# EAGLE design mod (EAGLE 7.1.0)
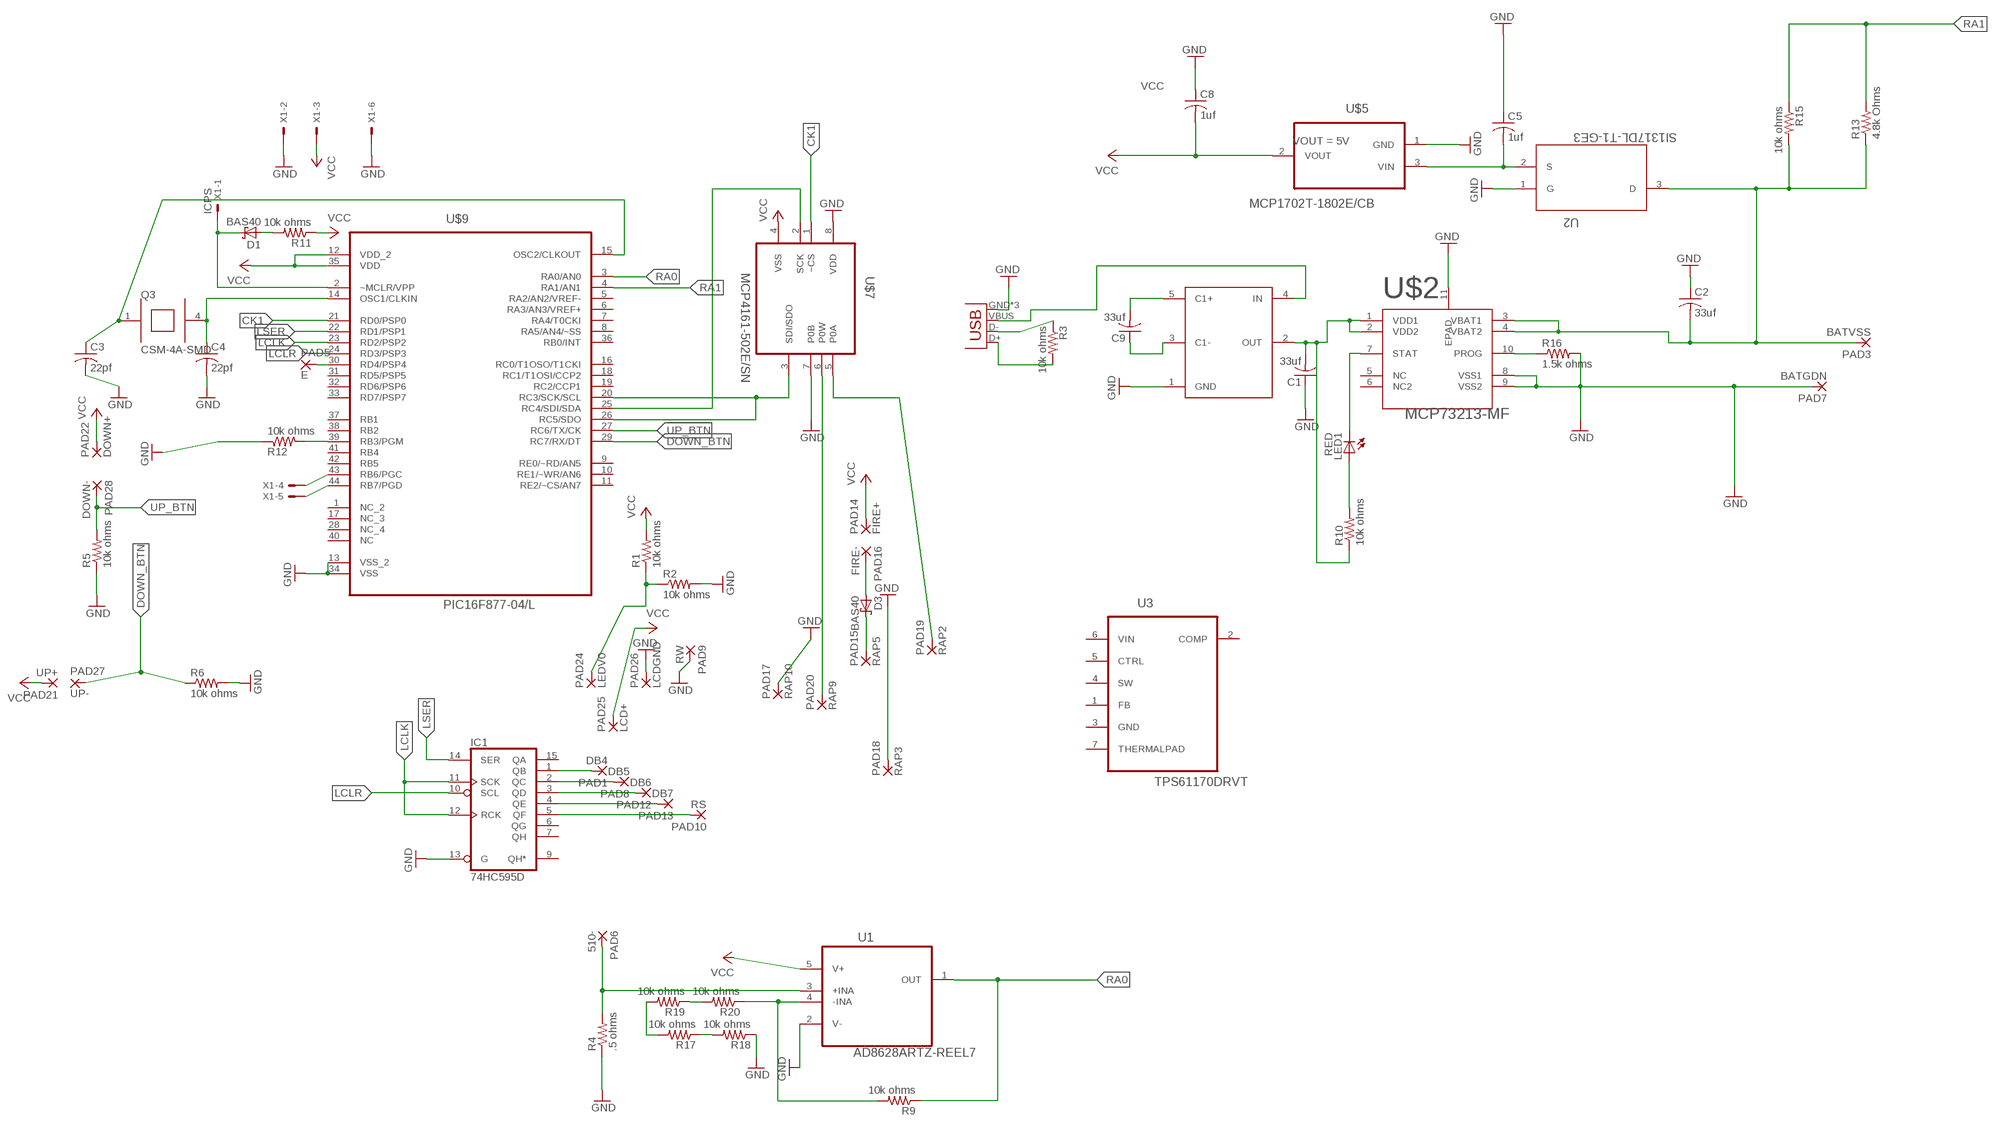
[diagram p0: schematic, sheet 1]

## Parts
C1  33uf  C-USC0805  [C0805]
C2  33uf  C-USC0805  [C0805]
C3  22pf  C-USC0805  [C0805]
C4  22pf  C-USC0805  [C0805]
C5  1uf  C-USC0805  [C0805]
C8  1uf  C-USC0805  [C0805]
C9  33uf  C-USC0805  [C0805]
D1  BAS40  [SOT23]
D3  BAS40  [SOT23]
IC1  74HC595D  [SO16]
LED1  RED  LEDCHIPLED_1206  [CHIPLED_1206]
PAD1  DB4  WIREPADSMD1,27-254  [SMD1,27-2,54]
PAD3  BATVSS  WIREPADSMD1,27-254  [SMD1,27-2,54]
PAD5  E  WIREPADSMD1,27-254  [SMD1,27-2,54]
PAD6  510-  WIREPADSMD1,27-254  [SMD1,27-2,54]
PAD7  BATGDN  WIREPADSMD1,27-254  [SMD1,27-2,54]
PAD8  DB5  WIREPADSMD1,27-254  [SMD1,27-2,54]
PAD9  RW  WIREPADSMD1,27-254  [SMD1,27-2,54]
PAD10  RS  WIREPADSMD1,27-254  [SMD1,27-2,54]
PAD12  DB6  WIREPADSMD1,27-254  [SMD1,27-2,54]
PAD13  DB7  WIREPADSMD1,27-254  [SMD1,27-2,54]
PAD14  FIRE+  WIREPADSMD1,27-254  [SMD1,27-2,54]
PAD15  RAP5  WIREPADSMD1,27-254  [SMD1,27-2,54]
PAD16  FIRE-  WIREPADSMD1,27-254  [SMD1,27-2,54]
PAD17  RAP10  WIREPADSMD1,27-254  [SMD1,27-2,54]
PAD18  RAP3  WIREPADSMD1,27-254  [SMD1,27-2,54]
PAD19  RAP2  WIREPADSMD1,27-254  [SMD1,27-2,54]
PAD20  RAP9  WIREPADSMD1,27-254  [SMD1,27-2,54]
PAD21  UP+  WIREPADSMD1,27-254  [SMD1,27-2,54]
PAD22  DOWN+  WIREPADSMD1,27-254  [SMD1,27-2,54]
PAD24  LEDV0  WIREPADSMD1,27-254  [SMD1,27-2,54]
PAD25  LCD+  WIREPADSMD1,27-254  [SMD1,27-2,54]
PAD26  LCDGND  WIREPADSMD1,27-254  [SMD1,27-2,54]
PAD27  UP-  WIREPADSMD1,27-254  [SMD1,27-2,54]
PAD28  DOWN-  WIREPADSMD1,27-254  [SMD1,27-2,54]
Q3  CSM-4A-SMD  [HC49/US]
R1  10k ohms  R-US_R0805  [R0805]
R2  10k ohms  R-US_R0805  [R0805]
R3  10k ohms  R-US_R0805  [R0805]
R4  .5 ohms  R-US_R0805  [R0805]
R5  10k ohms  R-US_R0805  [R0805]
R6  10k ohms  R-US_R0805  [R0805]
R9  10k ohms  R-US_R0805  [R0805]
R10  10k ohms  R-US_R0805  [R0805]
R11  10k ohms  R-US_R0805  [R0805]
R12  10k ohms  R-US_R0805  [R0805]
R13  4.8k Ohms  R-US_R0805  [R0805]
R15  10k ohms  R-US_R0805  [R0805]
R16  1.5k ohms  R-US_R0805  [R0805]
R17  10k ohms  R-US_R0805  [R0805]
R18  10k ohms  R-US_R0805  [R0805]
R19  10k ohms  R-US_R0805  [R0805]
R20  10k ohms  R-US_R0805  [R0805]
U1  AD8628ARTZ-REEL7  [SOT95P290X145-5N]
U2  SI1317DL-T1-GE3  [SOT65P210X110-3N]
U3  TPS61170DRVT  [SON65P210X210X80-7N]
U$2  MCP73213-MF  [10-DFN]
U$3  MAX1683-5-SOT23  [SOT23-1]
U$5  MCP1702T-1802E/CB  [SOT95P300X145-3N]
U$7  MCP4161-502E/SN  [SOIC127P600X175-8N]
U$9  PIC16F877-04/L  [PLCC127P1752X1752X457-44N]
X1  ICPS  22-23-2061  [22-23-2061]
X2  USB-MICROB  [USB-MICROB]

## Nets
AD_DC: C2.2 PAD3.1(P) R13.1 R15.2 U2.3(D) U$2.3(VBAT1) U$2.4(VBAT2)
CK1: U$7.1(~CS) U$9.21(RD0/PSP0)
CLKOUT: C3.1 Q3.1 U$9.15(OSC2/CLKOUT)
DOWN_BTN: PAD27.1(P) R6.1 U$9.29(RC7/RX/DT)
GND: C1.1 C2.1 C3.2 C4.2 C5.1 C8.1 IC1.13(G) PAD7.1(P) PAD9.1(P) PAD17.1(P) PAD18.1(P) PAD26.1(P) R2.2 R4.1 R5.1 R6.2 R12.1 R16.2 R18.1 U1.2(V-) U2.1(G) U$2.8(VSS1) U$2.9(VSS2) U$2.11(EPAD) U$3.1(GND) U$5.1(GND) U$7.7(P0B) U$7.8(VDD) U$9.13(VSS_2) U$9.34(VSS) X1.2 X1.6 X2.GND X2.MT1(GND) X2.MT2(GND)
LCLK: IC1.11(SCK) IC1.12(RCK) U$9.23(RD2/PSP2)
LCLR: IC1.10(SCL) U$9.24(RD3/PSP3)
LSER: IC1.14(SER) U$9.22(RD1/PSP1)
N$1: C5.2 U2.2(S) U$5.3(VIN)
N$2: D3.1(A) PAD16.1(P)
N$3: C4.1 Q3.4 U$9.14(OSC1/CLKIN)
N$4: D3.3(C) PAD15.1(P)
N$5: R3.1 X2.D-
N$7: PAD20.1(P) U$7.6(P0W)
N$8: PAD19.1(P) U$7.5(P0A)
N$9: R3.2 X2.D+
N$11: PAD6.1(P) R4.2 U1.3(+INA)
N$12: C9.2 U$3.5(C1+)
N$13: U$7.2(SCK) U$9.25(RC4/SDI/SDA)
N$14: U$7.3(SDI/SDO) U$9.20(RC3/SCK/SCL) U$9.26(RC5/SDO)
N$15: R9.2 R20.1 U1.4(-INA)
N$16: IC1.1(QB) PAD1.1(P)
N$18: D1.1(A) R11.2
N$19: D1.3(C) U$9.2(~MCLR/VPP) X1.1
N$20: IC1.2(QC) PAD8.1(P)
N$21: U$9.43(RB6/PGC) X1.4
N$22: U$9.44(RB7/PGD) X1.5
N$23: IC1.3(QD) PAD12.1(P)
N$24: R12.2 U$9.39(RB3/PGM)
N$25: IC1.4(QE) PAD13.1(P)
N$26: IC1.5(QF) PAD10.1(P)
N$27: PAD5.1(P) U$9.30(RD4/PSP4)
N$28: U$3.4(IN) X2.VBUS
N$29: C9.1 U$3.3(C1-)
N$30: C1.2 R10.1 U$2.1(VDD1) U$2.2(VDD2) U$3.2(OUT)
N$31: LED1.A R10.2
N$32: LED1.C U$2.7(STAT)
N$33: R16.1 U$2.10(PROG)
N$36: R19.1 R20.2
N$37: R17.2 R19.2
N$38: R17.1 R18.2
RA0: R9.1 U1.1(OUT) U$9.3(RA0/AN0)
RA1: R13.2 R15.1 U$9.4(RA1/AN1)
UP_BTN: PAD28.1(P) R5.2 U$9.27(RC6/TX/CK)
VCC: C8.2 PAD14.1(P) PAD21.1(P) PAD22.1(P) PAD25.1(P) R1.2 R11.1 U1.5(V+) U$5.2(VOUT) U$7.4(VSS) U$9.12(VDD_2) U$9.35(VDD) X1.3
VO: PAD24.1(P) R1.1 R2.1
Unconnected: IC1.6(QG) IC1.7(QH) IC1.9(QH*) IC1.15(QA) U3.1(FB) U3.2(COMP) U3.3(GND) U3.4(SW) U3.5(CTRL) U3.7(THERMALPAD) U$2.5(NC) U$2.6(NC2) U$9.1(NC_2) U$9.5(RA2/AN2/VREF-) U$9.6(RA3/AN3/VREF+) U$9.7(RA4/T0CKI) U$9.8(RA5/AN4/~SS) U$9.9(RE0/~RD/AN5) U$9.10(RE1/~WR/AN6) U$9.11(RE2/~CS/AN7) U$9.16(RC0/T1OSO/T1CKI) U$9.17(NC_3) U$9.18(RC1/T1OSI/CCP2) U$9.19(RC2/CCP1) U$9.28(NC_4) U$9.31(RD5/PSP5) U$9.32(RD6/PSP6) U$9.33(RD7/PSP7) U$9.36(RB0/INT) U$9.37(RB1) U$9.38(RB2) U$9.40(NC) U$9.41(RB4) U$9.42(RB5)

## Power pins joined to a net without a drawn wire
GND: IC1.8(GND)
VCC: IC1.16(VCC)
VIN: U3.6(VIN)

## Library data of the parts
C1 C2 C5 C8 C9 = adafruit:C-US: CAPACITOR, American symbol; MPN: RC0805JR-1347KL; OC_NEWARK: 68R0289
C3 C4 = adafruit:C-US: CAPACITOR, American symbol; MPN: MC0805N220J501CT; OC_NEWARK: 21T9850
D1 D3 = diode:BAS40: Silicon Schottky Diodes General-purpose diode for high-speed switching; VOLTS: 5.6
IC1 = 74xx-eu:74*595: 8-bit SHIFT REGISTER, output latch
LED1 = led:LED: LED OSRAM: - CHIPLED LG R971, LG N971, LY N971, LG Q971, LY Q971, LO R971, LY R971 LH N974, LH R974 LS Q976, LO Q976, LY Q976 LO Q996 - Hyper CHIPLED LW Q18S LB Q993, LB Q99A, LB R99A - SideLED LS A670, LO A670, LY A670, LG A670, LP A670 LB A673, LV A673, LT A673, LW A673 LH A674 LY A675 LS A676, LA A676, LO A676, LY A676, LW A676 LS A679, LY A679, LG A679 - Hyper Micro SIDELED® LS Y876, LA Y876, LO Y876, LY Y876 LT Y87S - SmartLED LW L88C, LW L88S LB L89C, LB L89S, LG L890 LS L89K, LO L89K, LY L89K LS L896, LA L896, LO L896, LY L896 - TOPLED LS T670, LO T670, LY T670, LG T670, LP T670 LSG T670, LSP T670, LSY T670, LOP T670, LYG T670 LG T671, LOG T671, LSG T671 LB T673, LV T673, LT T673, LW T673 LH T674 LS T676, LA T676, LO T676, LY T676, LB T676, LH T676, LSB T676, LW T676 LB T67C, LV T67C, LT T67C, LS T67K, LO T67K, LY T67K, LW E67C LS E67B, LA E67B, LO E67B, LY E67B, LB E67C, LV E67C, LT E67C LW T67C LS T679, LY T679, LG T679 LS T770, LO T770, LY T770, LG T770, LP T770 LB T773, LV T773, LT T773, LW T773 LH T774 LS E675, LA E675, LY E675, LS T675 LS T776, LA T776, LO T776, LY T776, LB T776 LHGB T686 LT T68C, LB T68C - Hyper Mini TOPLED® LB M676 - Mini TOPLED Santana® LG M470 LS M47K, LO M47K, LY M47K Source: http://www.osram.convergy.de LUXEON: - LUMILED® LXK2-PW12-R00, LXK2-PW12-S00, LXK2-PW14-U00, LXK2-PW14-V00 LXK2-PM12-R00, LXK2-PM12-S00, LXK2-PM14-U00 LXK2-PE12-Q00, LXK2-PE12-R00, LXK2-PE12-S00, LXK2-PE14-T00, LXK2-PE14-U00 LXK2-PB12-K00, LXK2-PB12-L00, LXK2-PB12-M00, LXK2-PB14-N00, LXK2-PB14-P00, LXK2-PB14-Q00 LXK2-PR12-L00, LXK2-PR12-M00, LXK2-PR14-Q00, LXK2-PR14-R00 LXK2-PD12-Q00, LXK2-PD12-R00, LXK2-PD12-S00 LXK2-PH12-R00, LXK2-PH12-S00 LXK2-PL12-P00, LXK2-PL12-Q00, LXK2-PL12-R00 Source: www.luxeon.com KINGBRIGHT: KA-3528ASYC Source: www.kingbright.com
PAD1 PAD3 PAD5-PAD10 PAD12-PAD22 PAD24-PAD28 = wirepad:WIREPAD: Wire PAD connect wire on PCB
Q3 = MikeLib:CSM-4A-SMD
R1 R2 R4-R6 R9 R11-R13 R15-R20 = resistor:R-US_: RESISTOR, American symbol; MPN: CRCW080510K0FKEB; OC_NEWARK: 26R4046
R3 R10 = resistor:R-US_: RESISTOR, American symbol; MPN: CRCW0805220RJNEA; OC_NEWARK: 59M6876
U1 = ADI-Phase-2:AD8628ARTZ-REEL7: Zero-Drift, Single-Supply, RRIO Op Amp; MPN: AD8628ARTZ-REEL7; OC_FARNELL: unknown; OC_NEWARK: 59K6995; PACKAGE: SOT-23-5; SUPPLIER: Analog Devices
U2 = Vishay_By_element14_Batch_1:SI1317DL-T1-GE3: P-Channel 20 V (D-S) MOSFET; MPN: SI1317DL-T1-GE3; OC_FARNELL: 2056676; OC_NEWARK: 64T4051; PACKAGE: SOT-323-3; SUPPLIER: VISHAY SILICONIX
U3 = Texas Instruments_By_element14_Batch_1:TPS61170DRVT: 1.2A High Voltage Boost Converter in 2x2mm2 QFN Package; MPN: TPS61170DRVT; OC_FARNELL: 1703404; OC_NEWARK: 65M6342; PACKAGE: SON-6; SUPPLIER: Texas Instruments
U$2 = MikeLib:MCP73213-MF
U$3 = MikeLib:MAX1683-5-SOT23
U$5 = Microchip_By_element14_Batch_1:MCP1702T-1802E/CB: Low Quiescent Current LDO Regulator; DESCRIPTION: LDO VOLT REG; MPN: MCP1702T-1802E/CB; OC_FARNELL: 1331488; OC_NEWARK: 84R5177; PACKAGE: SOT-3; SUPPLIER: Microchip; VOUT: 5V
U$7 = Microchip_By_element14_Batch_1:MCP4161-502E/SN: Digital POT; MPN: MCP4161-502E/SN; OC_FARNELL: 1840839; OC_NEWARK: 77M2747; PACKAGE: SOIC-8; SUPPLIER: Microchip
U$9 = Microchip_By_element14_Batch_1:PIC16F877-04/L: 8-Bit CMOS FLASH Microcontrollers; MF: MICROCHIP; MPN: PIC16F877-04/L; OC_FARNELL: 9761330; OC_NEWARK: 23C5092; PACKAGE: PLCC-44; SUPPLIER: Microchip
X1 = con-molex:22-23-2061: .100" (2.54mm) Center Header - 6 Pin; MF: MOLEX; MPN: 22-23-2061; OC_FARNELL: 1462922; OC_NEWARK: 27C1933
X2 = SparkFun-Connectors:USB: USB Connectors USB-B-PTH is fully proven SKU : PRT-00139/CONN-08278 USB-miniB is fully proven SKU : PRT-00587 USB-A-PCB is untested. USB-A-H is throughly reviewed, but untested. Spark Fun Electronics SKU : PRT-00437 USB-B-SMT is throughly reviewed, but untested. Needs silkscreen touching up. USB-A-S has not been used/tested USB-MB-H has not been used/tested USB-MICROB has been used. CONN-09505; PROD_ID: CONN-09505

## Board
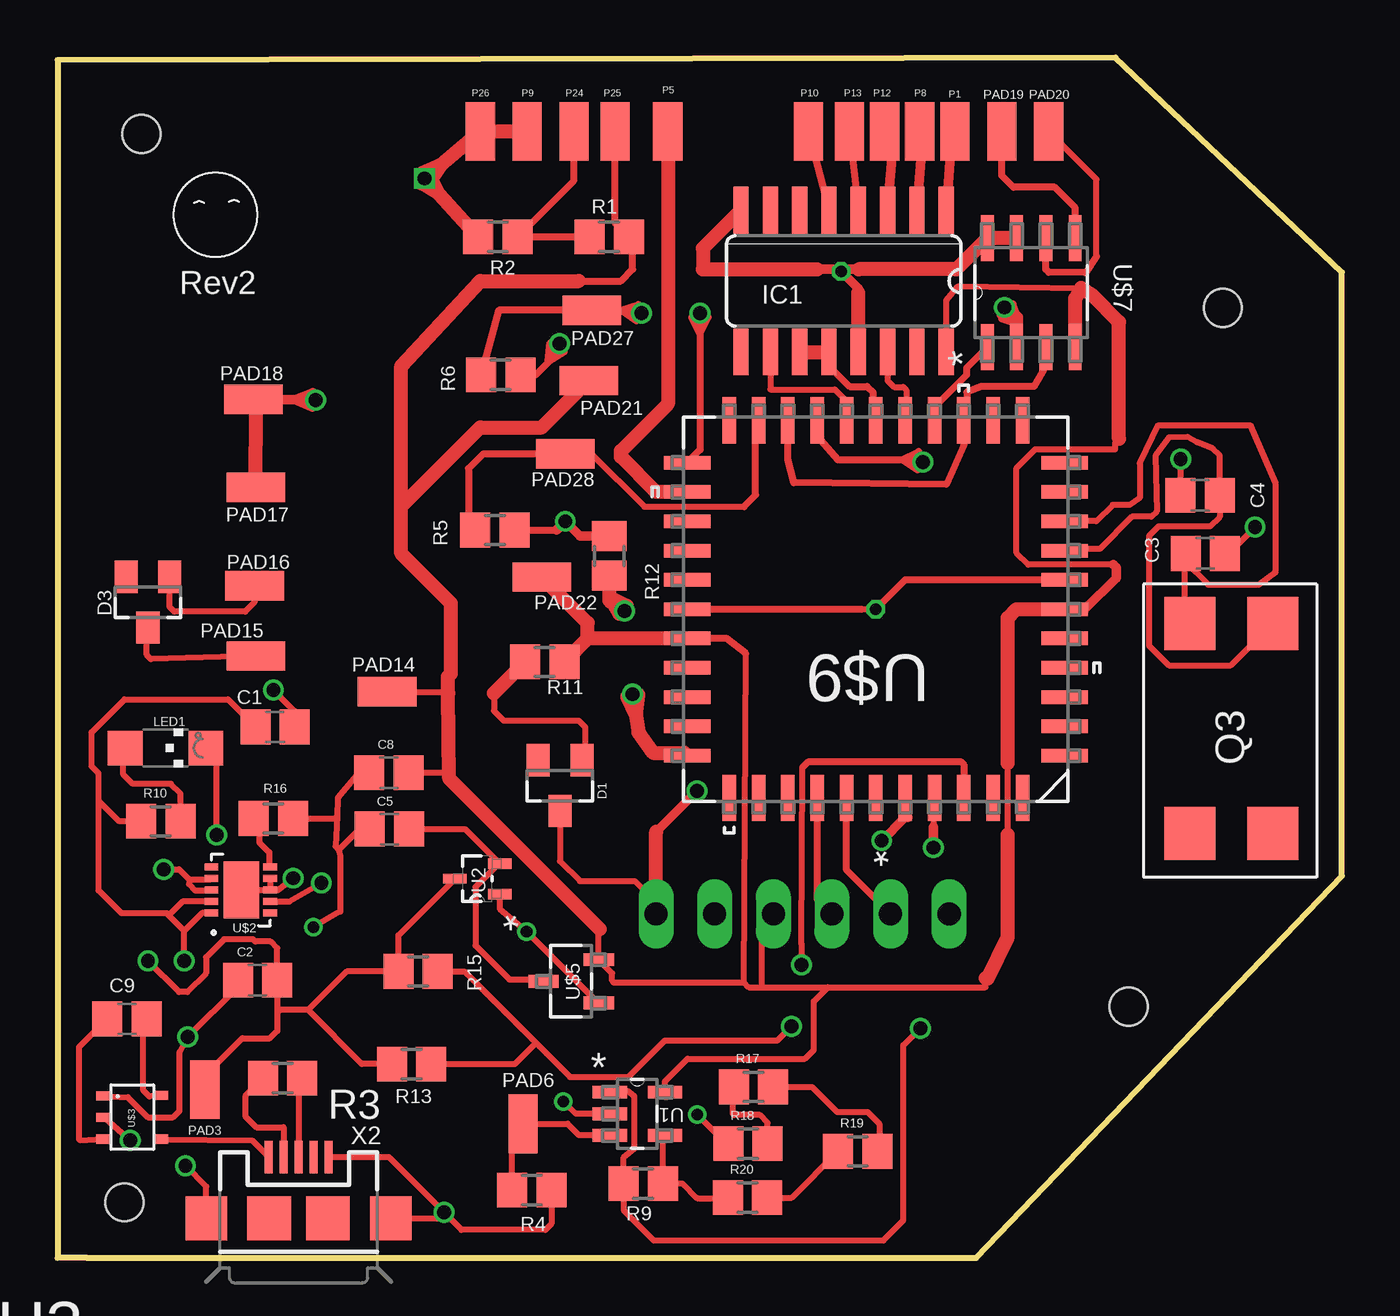
[diagram p1: board, top side]
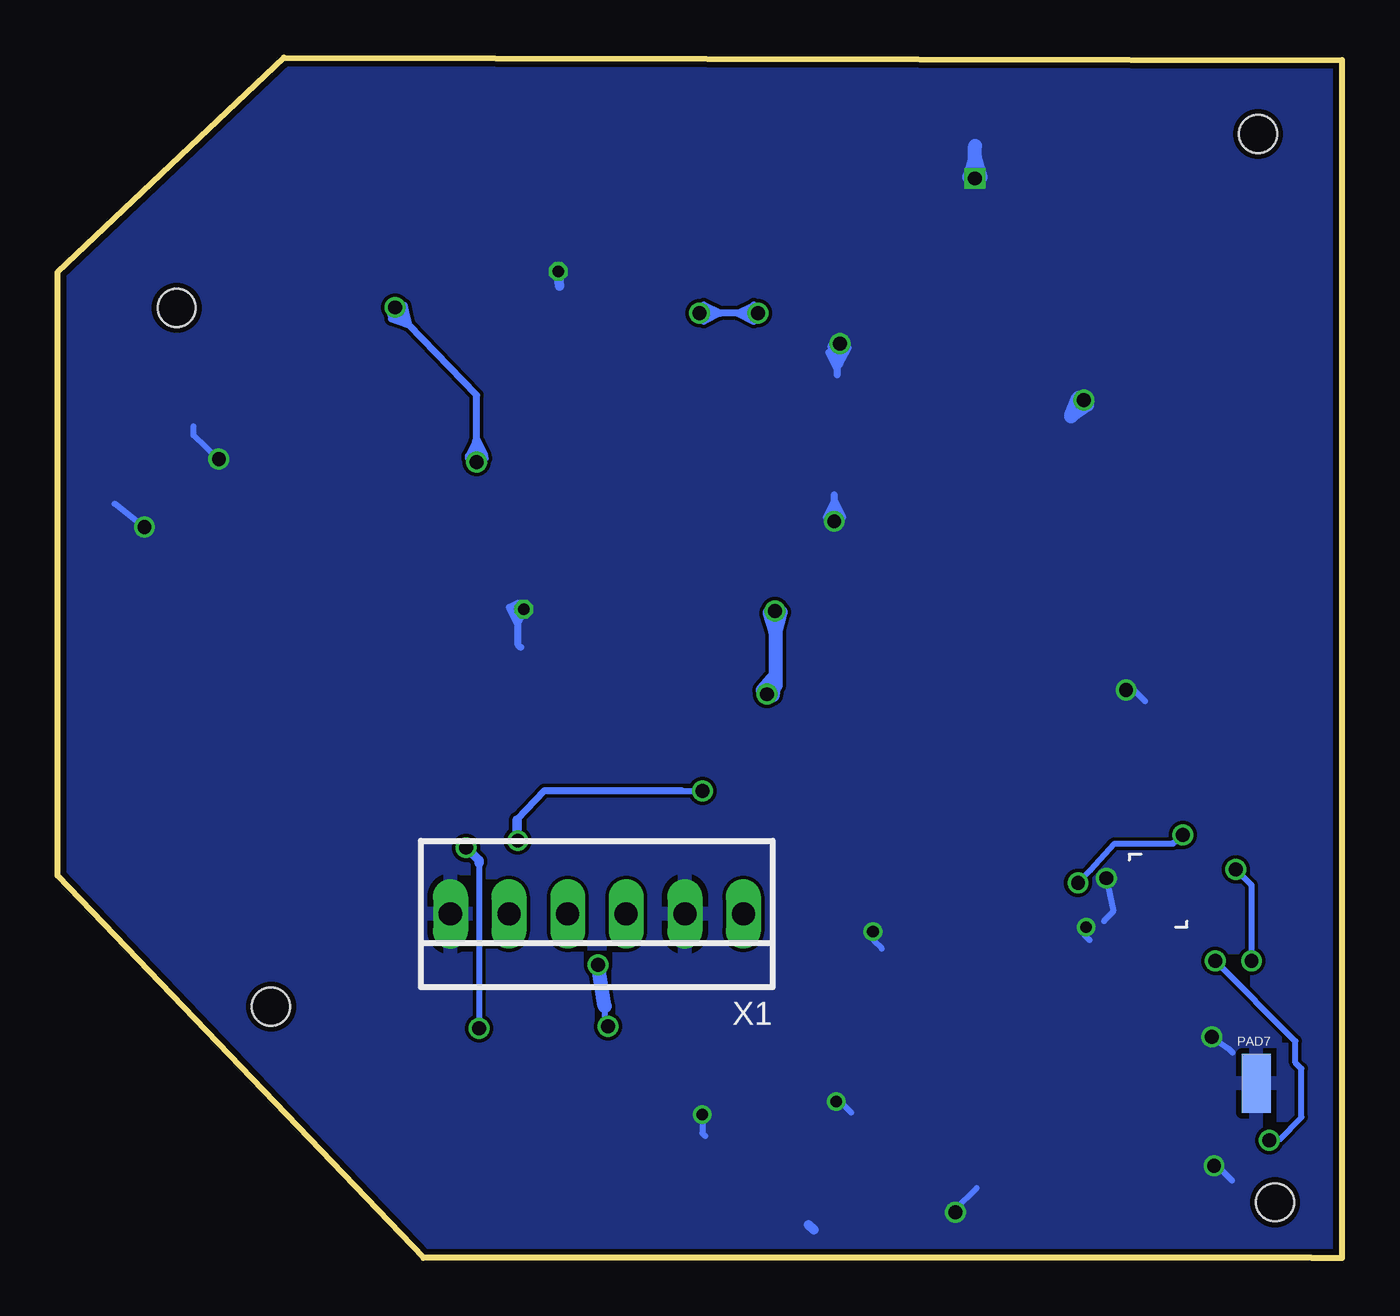
[diagram p2: board, bottom side, seen from below]

Size 55.65 x 52.02 mm. Coordinates in mm from the lower left corner, seen from the top.
Outline: 1.32,0 39.8,0 55.65,16.56 55.65,42.72 45.85,52.02 0,51.92 0,0 1.27,0
Copper layers (1*16): Top 0.035mm / dielectric 1.5mm / Bottom 0.035mm
Design rules "SeeedStudio_2layer_DRU_no_angle_20140221 *": minimum track width 6mil, minimum drill 12mil, track to track 6mil, track to pad 6mil, pad to pad 6mil, via to via 6mil, smd to smd 6mil, copper to edge 10mil, drill to drill 10mil, minimum pad ring 10mil, minimum via ring 6mil, stop-mask expansion 2mil, vias tented up to drill 100mil, thermal gap 10mil
Holes 1.65 mm at 3.63,48.72 50.5,41.17 46.41,10.9 2.9,2.41

### Footprints (pad centres in the part's own frame; a part is rotated, then mirrored left to right if it is on the bottom)
C0805 = smd 1.3 x 1.5: 1 -0.85,0; 2 0.85,0
SOT23 = smd 1 x 1.4: 1 -0.95,-1.1; 2 0.95,-1.1; 3 0,1.1
SO16 = smd 0.66 x 2.032: 1 -4.445,-3.073; 2 -3.175,-3.073; 3 -1.905,-3.073; 4 -0.635,-3.073; 5 0.635,-3.073; 6 1.905,-3.073; 7 3.175,-3.073; 8 4.445,-3.073; 9 4.445,3.073; 10 3.175,3.073; 11 1.905,3.073; 12 0.635,3.073; 13 -0.635,3.073; 14 -1.905,3.073; 15 -3.175,3.073; 16 -4.445,3.073
CHIPLED_1206 = smd 1.5 x 1.5: A 0,-1.75; C 0,1.75
SMD1,27-2,54 = smd 1.27 x 2.54: 1 0,0
HC49/US = smd 2.3 x 2.2: 1 -2,-0.7; 2 7.1,-0.7; 3 7.1,2.9; 4 -2,2.9
R0805 = smd 1.3 x 1.5: 1 -0.85,0; 2 0.85,0
SOT95P290X145-5N = smd 1.473 x 0.559: 1 -1.194,0.94; 2 -1.194,0; 3 -1.194,-0.94; 4 1.194,-0.94; 5 1.194,0.94
SOT65P210X110-3N = smd 1.016 x 0.457: 1 -0.965,0.66; 2 -0.965,-0.66 | smd 1.016 x 0.406: 3 0.965,0
SON65P210X210X80-7N = smd 0.61 x 0.356: 1 -1.041,0.66; 2 -1.041,0; 3 -1.041,-0.66; 4 1.041,-0.66; 5 1.041,0; 6 1.041,0.66 | smd 0.991 x 1.6: 7 0,0
10-DFN = smd 0.3 x 0.6: 1 -4,0.3; 2 -3.5,0.3; 3 -3,0.3; 4 -2.5,0.3; 5 -2,0.3; 6 -4,-2.25; 7 -3.5,-2.25; 8 -3,-2.25; 9 -2.5,-2.25; 10 -2,-2.25 | smd 2.48 x 1.55: 11 -3,-1
SOT23-1 = smd 0.4 x 0.575: 1 -2.68,0.05; 2 -1.755,0.045; 3 -0.81,0.05; 4 -0.805,2.6; 5 -2.705,2.605
SOT95P300X145-3N = smd 0.559 x 1.321: 1 -0.94,-1.194; 2 0.94,-1.194; 3 0,1.194
SOIC127P600X175-8N = smd 1.981 x 0.559: 1 -2.362,1.905; 2 -2.362,0.635; 3 -2.362,-0.635; 4 -2.362,-1.905; 5 2.362,-1.905; 6 2.362,-0.635; 7 2.362,0.635; 8 2.362,1.905
PLCC127P1752X1752X457-44N = smd 0.584 x 2.007: 1 0,8.179; 2 -1.27,8.179; 3 -2.54,8.179; 4 -3.81,8.179; 5 -5.08,8.179; 6 -6.35,8.179; 18 -6.35,-8.179; 19 -5.08,-8.179; 20 -3.81,-8.179; 21 -2.54,-8.179; 22 -1.27,-8.179; 23 0,-8.179; 24 1.27,-8.179; 25 2.54,-8.179; 26 3.81,-8.179; 27 5.08,-8.179; 28 6.35,-8.179; 40 6.35,8.179; 41 5.08,8.179; 42 3.81,8.179; 43 2.54,8.179; 44 1.27,8.179 | smd 2.007 x 0.584: 7 -8.179,6.35; 8 -8.179,5.08; 9 -8.179,3.81; 10 -8.179,2.54; 11 -8.179,1.27; 12 -8.179,0; 13 -8.179,-1.27; 14 -8.179,-2.54; 15 -8.179,-3.81; 16 -8.179,-5.08; 17 -8.179,-6.35; 29 8.179,-6.35; 30 8.179,-5.08; 31 8.179,-3.81; 32 8.179,-2.54; 33 8.179,-1.27; 34 8.179,0; 35 8.179,1.27; 36 8.179,2.54; 37 8.179,3.81; 38 8.179,5.08; 39 8.179,6.35
22-23-2061 = drill 1 long: 1 -6.35,0; 2 -3.81,0; 3 -1.27,0; 4 1.27,0; 5 3.81,0; 6 6.35,0
USB-MICROB = smd 0.35 x 1.4: D+ 0,2.65; D- -0.65,2.65; GND 1.3,2.65; ID 0.65,2.65; VBUS -1.3,2.65 | smd 1.8 x 1.9: MT1 -4,0; MT2 4,0 | smd 1.9 x 1.9: P$1 -1.27,0; P$2 1.27,0

### Placement (x,y rotation side)
C1  9.42,23.01 180 top
C2  8.66,12.04 0 top
C3  49.73,30.53 0 top
C4  49.5,33.05 180 top
C5  14.38,18.59 0 top
C8  14.35,21.03 0 top
C9  3,10.36 0 top
D1  21.77,20.47 180 top
D3  3.91,28.42 180 top
IC1  34.06,42.34 180 top
LED1  4.67,22.1 270 top
PAD1  38.89,48.82 180 top
PAD3  6.38,7.29 0 top
PAD5  26.44,48.82 0 top
PAD6  20.17,5.82 180 top
PAD7  3.71,7.57 180 bottom
PAD8  37.36,48.82 180 top
PAD9  20.35,48.82 0 top
PAD10  32.54,48.82 0 top
PAD12  35.84,48.82 0 top
PAD13  34.32,48.82 180 top
PAD14  14.27,24.54 90 top
PAD15  8.59,26.09 270 top
PAD16  8.53,29.13 270 top
PAD17  8.59,33.4 90 top
PAD18  8.48,37.21 90 top
PAD19  40.92,48.82 0 top
PAD20  42.95,48.82 0 top
PAD21  23.01,38.02 90 top
PAD22  20.98,29.51 90 top
PAD24  22.38,48.82 0 top
PAD25  24.16,48.82 0 top
PAD26  18.31,48.82 0 top
PAD27  23.14,41.07 90 top
PAD28  22,34.85 90 top
Q3  49.76,25.5 270 top
R1  23.9,44.25 0 top
R2  19.08,44.25 180 top
R3  9.75,7.8 0 top
R4  20.55,2.95 180 top
R5  18.95,31.55 180 top
R6  19.2,38.28 0 top
R9  25.37,3.23 0 top
R10  4.47,18.92 0 top
R11  21.11,25.83 180 top
R12  23.9,30.43 270 top
R13  15.34,8.41 0 top
R15  15.62,12.42 180 top
R16  9.35,19.05 0 top
R17  30.15,7.42 0 top
R18  29.92,4.95 0 top
R19  34.67,4.62 0 top
R20  29.9,2.62 0 top
U1  25.12,6.25 0 top
U2  18.19,16.43 180 top
U3  0.84,-5.84 0 top  (outside the outline)
U$1  [WINKLOGO]  4.98,43.36 0 top
U$2  6.96,18.95 90 top
U$3  1.91,4.34 270 top
U$5  22.25,11.99 90 top
U$7  42.19,41.83 90 top
U$9  35.46,28.12 180 top
X1  32.28,14.91 180 bottom
X2  10.44,1.73 0 top

### Tracks (layer width: path | path; a pad name or v marks a point on that pad's centre or on a via)
AD_DC  (via drill 0.6)
  Top 0.254: PAD3.1 6.38,7.9 8,9.52 9.19,9.52 9.51,9.84 9.51,10.62 | v3.91,12.88 5.26,11.53 5.61,11.53 6.43,12.34 6.43,13.03 7.21,13.82 8.46,13.82 8.56,13.72 9.22,13.72 9.51,13.42 C2.2 9.51,10.62 | v4.6,16.84 5.26,16.84 5.69,16.41 | 5.69,16.41 6.62,16.41 U$2.4 | 5.69,16.41 5.69,16.2 5.97,15.93 6.64,15.93 U$2.3 | 10.85,10.74 12.52,12.42 R15.2 14.77,13.98 U2.3 | 10.85,10.74 9.64,10.74 9.51,10.62 | R13.1 13.18,8.41 10.85,10.74
  Bottom 0.254: v3.91,12.88 3.91,16.15 v4.6,16.84
CK1
  Top 0.305: U$9.21 38,36.88 39.4,38.28 39.4,38.58 U$7.1
CLKOUT
  Top 0.254: 48.83,30.21 48.83,27.73 Q3.1 | C3.1 48.83,30.21 | 48.83,30.21 49.86,29.18 52.04,29.18 52.78,29.72 52.78,33.58 51.71,36.07 47.68,36.07 47.42,35.53 46.89,34.44 46.89,32.94 46.46,32.64 45.72,32.64 45.01,31.93 U$9.15 43.66,31.9
DOWN_BTN  (via drill 0.6)
  Top 0.305: R6.1 19.11,41.07 PAD27.1 24.41,41.07 | 24.41,41.07 25.43,41.07 v25.3,40.94 | v27.84,40.94 27.84,40.04 | 27.84,40.04 27.84,35.03 U$9.29 | 24.41,41.07 25.07,40.61 v25.3,40.94 | 24.41,41.07 25.17,41.33 v25.3,40.94 | 27.84,40.04 28.2,40.77 | 28.2,40.77 | v27.84,40.94 28.2,40.77 | 27.84,40.04 27.48,40.77 | v27.84,40.94 27.48,40.77 | 27.84,40.04 28.2,40.77 | v27.84,40.94 28.2,40.77 | 27.84,40.04 27.48,40.77 | v27.84,40.94 27.48,40.77
  Bottom 0.305: v25.3,40.94 26.2,40.94 | 26.2,40.94 26.94,40.94 | 26.94,40.94 v27.84,40.94 | 26.2,40.94 25.48,41.3 | 25.48,41.3 | v25.3,40.94 25.48,41.3 | 26.2,40.94 25.48,40.59 | v25.3,40.94 25.48,40.59 | 26.2,40.94 25.48,41.3 | v25.3,40.94 25.48,41.3 | 26.2,40.94 25.48,40.59 | v25.3,40.94 25.48,40.59 | 26.94,40.94 | 26.94,40.94 | 26.94,40.94 27.66,41.3 | 26.94,40.94 27.66,40.59 | 27.66,40.59 | v27.84,40.94 27.66,40.59 | 26.94,40.94 27.66,41.3 | v27.84,40.94 27.66,41.3 | 26.94,40.94 27.66,40.59 | v27.84,40.94 27.66,40.59 | 26.94,40.94 27.66,41.3 | v27.84,40.94 27.66,41.3
GND  (via drill 0.5, 0.6)
  Top 0.254: U$3.1 3.04,6.97 3.91,6.1 5,6.1 5.28,6.38 5.28,8.92 v5.64,9.58 7.81,11.75 C2.1 | C5.1 13.08,18.59 12.18,17.69 | 12.18,17.69 12.24,17.42 12.24,15.01 v11.08,14.34 10.97,14.27 | C8.1 13.06,21.03 12.14,19.94 12.1,19.13 | 12.1,19.13 12.04,17.86 12.18,17.69 | C1.1 10.25,23.71 v9.35,24.61 | 10.97,37.39 v11.18,37.19 | C3.2 50.75,30.53 v51.89,31.67 | C4.2 v48.67,34.62 | X2.MT2 16.48,1.73 v16.74,1.98 | X2.MT1 6.44,3.09 v5.54,3.99 | X2.GND 14.34,4.38 v16.74,1.98 | 8.36,33.17 PAD17.1 | R16.2 12.03,19.05 12.1,19.13 | U$2.9 U$2.8 | U$2.8 9.55,15.95 v10.21,16.46 | 34.85,28.12 v35.46,28.12 | U$2.11 U$2.8 | R18.1 28.98,4.95 v27.71,6.22 | R4.1 21.4,1.48 21.13,1.22 17.5,1.22 v16.74,1.98 | U1.2 22.45,6.25 v21.92,6.78 | U2.1 19.15,15.14 v20.32,14.15 23.27,11.2 U$5.1
  Top 0.305: 43.8,29.22 U$9.13 36.73,29.39 v35.46,28.12 | U$9.34 34.85,28.12 | R5.1 21.62,31.55 | R6.2 20.73,38.28 21.23,38.78 | 21.23,38.78 v21.74,39.62 | 21.23,38.78 21.26,38.86 | 21.26,38.86 21.49,39.55 v21.74,39.62 | v21.74,39.62 21.96,39.28 21.28,38.85 21.34,39.66 v21.74,39.62 | 21.26,38.86 21.95,39.28 v21.74,39.62 | 21.26,38.86 21.34,39.67 v21.74,39.62
  Top 0.406: PAD18.1 10.28,37.21 | 10.28,37.21 11.18,37.21 v11.18,37.19 | 10.28,37.21 11.03,36.87 v11.18,37.19 | 10.28,37.21 11.05,37.51 v11.18,37.19 | 21.62,31.55 v22,31.93 22.65,31.28 R12.1 | 32.91,42.85 33.86,42.85 v33.96,42.75 | 34.71,42.85 34.06,42.85 v33.96,42.75 | 34.7,41.83 34.7,42.01 v33.96,42.75 | U$2.11 7.96,16.3 7.75,16.51
  Top 0.61: PAD17.1 8.61,36.96 PAD18.1 | R2.2 v15.9,46.79 | 16.59,47.37 PAD26.1 PAD9.1 | 16.59,47.37 v15.9,46.79 | IC1.8 27.97,43.76 27.97,42.85 32.91,42.85 | IC1.13 34.7,41.83 | U$7.7 U$7.8 38.94,42.85 34.71,42.85 | 16.51,46.12 16.12,46.9 | v15.9,46.79 16.12,46.9 | 16.51,46.12 15.77,46.57 | v15.9,46.79 15.77,46.57 | 16.51,46.12 16.12,46.9 | v15.9,46.79 16.12,46.9 | 16.51,46.12 15.77,46.57 | v15.9,46.79 15.77,46.57 | 16.59,47.37 15.8,47.01 v15.9,46.79 | 16.59,47.37 16.11,46.65 v15.9,46.79
  Bottom 0.254: v5.64,9.58 4.9,9.07 4.72,8.89 | 10.97,14.27 11.18,14.02 11.08,13.93 | v9.35,24.61 9.02,24.61 8.53,24.13 | 49.76,36.04 49.76,35.66 v48.67,34.62 | v51.89,31.67 53.19,32.69 | v16.74,1.98 16.74,2.11 15.82,3.02 | v5.54,3.99 5.38,3.99 4.75,3.35 | v10.21,16.46 9.91,15.01 10.31,14.6 | v35.46,28.12 35.42,28.12 35.4,28.1 | v27.71,6.22 27.71,5.41 27.58,5.28 | v21.92,6.78 21.74,6.78 21.26,6.3 | v11.08,14.34 11.08,13.93 | 11.08,13.93 10.92,13.77 | v20.32,14.15 20.29,13.77 19.94,13.41
  Bottom 0.305: 35.71,28.37 35.71,27.47 | 35.71,27.47 35.71,26.59 35.59,26.47 | v22,31.93 22,32.83 | 22,32.83 22,33.07 | v21.74,39.62 21.87,38.52 | 21.87,38.52 21.87,38.28 | 21.87,38.52 21.99,38.76 | 21.99,38.76 22.23,39.24 v21.74,39.62 | 21.87,38.52 21.51,39.24 v21.74,39.62 | 35.71,27.47 36.07,28.19 | 36.07,28.19 | 35.71,28.37 36.07,28.19 | 35.71,27.47 35.4,28.1 | 35.4,28.1 35.35,28.19 | 35.71,28.37 35.35,28.19 | 35.71,27.47 36.07,28.19 | 35.71,28.37 36.07,28.19 | 35.71,27.47 35.4,28.1 | 35.4,28.1 35.35,28.19 | 35.71,28.37 35.35,28.19 | 22,32.83 | 22,32.83 | 22,32.83 22.36,32.11 | 22,32.83 21.64,32.11 | 21.64,32.11 | v22,31.93 21.64,32.11 | 22,32.83 22.36,32.11 | 22,32.83 21.64,32.11 | v22,31.93 21.64,32.11 | v22,31.93 22.36,32.11 | v21.74,39.62 22.12,39.49 21.85,38.73 21.41,39.4 v21.74,39.62 | 21.99,38.76 22.14,39.55 v21.74,39.62 | 21.99,38.76 21.45,39.35 v21.74,39.62 | v21.74,39.62 22.11,39.45 21.77,38.72 21.39,39.43 v21.74,39.62
  Bottom 0.406: 22.89,1.22 23.11,1.45 | v33.96,42.75 33.91,42.11
  Bottom 0.61: v15.9,46.79 15.9,47.69 | 15.9,47.69 15.9,48.18 | 11.73,36.48 11.03,36.98 | v11.18,37.19 11.03,36.98 | 11.73,36.48 11.41,37.28 v11.18,37.19 | 11.73,36.48 11.03,36.98 | v11.18,37.19 11.03,36.98 | 15.9,47.69 15.66,46.86 | v15.9,46.79 15.66,46.86 | 15.9,47.69 16.14,46.86 | v15.9,46.79 16.14,46.86 | 15.9,47.69 15.66,46.86 | 15.9,47.69 16.14,46.86 | 15.9,47.69 15.66,46.86 | v15.9,46.79 15.66,46.86 | 15.9,47.69 16.14,46.86 | v15.9,46.79 16.14,46.86
  pour Bottom: 41.3,56.06 72.26,37.8 72.26,16.21 39.01,-0.08 -1.88,-0.08 -2.9,0.94 -2.9,55.93 -3.02,56.06
LCLK
  Top 0.305: IC1.12 33.43,38.66 34.32,37.77 35.08,37.77 35.33,37.52 35.33,36.42 U$9.23
  Top 0.61: IC1.11 IC1.12
LCLR
  Top 0.254: IC1.10 30.89,37.64 33.68,37.64 34.19,37.13 U$9.24
LSER
  Top 0.254: IC1.14 35.97,38.02 36.25,37.74 36.65,37.74 36.78,37.62 36.78,36.35 U$9.22
N$1
  Top 0.254: C5.2 17.65,18.59 U2.2 19.13,17.09 18.11,16.08 18.11,13.54 19.58,12.06 20.98,12.06 U$5.3
N$2
  Top 0.254: PAD16.1 8.53,28.42 8.13,28.02 5.05,28.02 4.85,28.22 D3.1
N$3
  Top 0.254: Q3.4 50.84,25.68 48.16,25.68 47.29,26.54 47.29,31.29 47.7,31.7 49.94,31.7 50.35,32.12 C4.1 50.35,34.79 50.06,35.08 49.38,35.36 48.97,35.59 48.16,35.56 47.57,34.77 47.63,32.36 47.4,32.13 46.56,32.13 45.16,30.73 43.71,30.73 U$9.14
N$4
  Top 0.254: PAD15.1 4.04,25.96 3.86,26.14 3.86,27.27 D3.3
N$5
  Top 0.254: R3.1 8.13,7.02 8.13,6.15 8.61,5.66 9.78,5.66 9.79,5.65 X2.D-
N$7
  Top 0.254: 45.02,43.4 45.02,46.75 PAD20.1
  Top 0.305: 45.02,43.4 44.55,42.7 42.95,42.72 42.82,42.85 U$7.6
N$8
  Top 0.305: U$7.5 44.09,45.52 43.21,46.41 41.43,46.41 40.92,46.91 PAD19.1
N$9
  Top 0.254: R3.2 10.44,7.63 X2.D+
N$11
  Top 0.254: R4.2 19.7,5.35 PAD6.1 22.1,5.82 22.58,5.33 23.9,5.33 U1.3
N$12
  Top 0.254: U$3.5 3.98,7 3.71,7.26 3.71,10.22 C9.2
N$13  (via drill 0.6)
  Top 0.254: 41.43,39.34 U$7.2
  Top 0.305: U$9.25 32.92,35.61 33.81,34.59 36.59,34.59 | 36.59,34.59 v37.49,34.49 | v41.02,41.2 41.55,40.94 41.68,40.82 41.68,40.59 | 41.68,40.59 41.68,40.43 | 41.68,40.43 41.68,39.6 U$7.2 | 36.59,34.59 36.6,34.59 | 36.6,34.59 37.31,34.24 v37.49,34.49 | 36.59,34.59 36.6,34.6 | 36.6,34.6 37.31,34.95 v37.49,34.49 | 41.68,40.43 41.64,40.55 | 41.64,40.55 41.43,41.2 v41.02,41.2 | 41.68,40.43 40.92,40.69 v41.02,41.2 | 37.27,34.16 36.6,34.59 37.35,34.87 v37.49,34.49 | v37.49,34.49 37.27,34.16 | 36.6,34.59 37.27,34.16 | v37.49,34.49 37.27,34.16 | 36.6,34.59 37.35,34.87 v37.49,34.49 | 36.6,34.6 37.27,34.16 v37.49,34.49 | 36.6,34.6 37.35,34.87 v37.49,34.49 | 41.68,40.59 41.4,41.34 v41.02,41.2 | 41.68,40.59 40.91,40.81 v41.02,41.2 | 41.64,40.55 41.4,41.32 v41.02,41.2 | 41.64,40.55 40.89,40.82 v41.02,41.2 | v41.02,41.2 41.42,41.27 41.56,40.48 40.84,40.84 v41.02,41.2
  Bottom 0.305: v37.49,34.49 37.49,35.39 | 37.49,35.39 37.49,35.49 | 37.49,35.49 37.49,37.39 40.42,40.42 | 40.42,40.42 40.47,40.49 | 40.47,40.49 v41.02,41.2 | 37.49,35.49 37.13,34.77 v37.49,34.49 | 37.49,35.49 37.54,35.39 | 37.54,35.39 37.85,34.77 v37.49,34.49 | 40.42,40.42 40.51,40.46 | 40.51,40.46 41.18,40.69 v41.02,41.2 | 40.42,40.42 40.66,41.19 v41.02,41.2 | 37.49,35.39 37.13,34.67 v37.49,34.49 | 37.49,35.39 37.85,34.67 v37.49,34.49 | v37.49,34.49 37.12,34.65 37.44,35.39 37.84,34.69 v37.49,34.49 | 37.54,35.39 37.14,34.69 v37.49,34.49 | 37.54,35.39 37.86,34.65 v37.49,34.49 | 40.47,40.49 41.2,40.84 v41.02,41.2 | 40.47,40.49 40.63,41.28 v41.02,41.2 | 40.51,40.46 41.22,40.85 v41.02,41.2 | 40.51,40.46 40.62,41.25 v41.02,41.2 | v41.02,41.2 41.18,40.83 40.45,40.51 40.63,41.29 v41.02,41.2
N$14
  Top 0.305: U$7.3 42.82,38.66 42.32,37.77 40.03,37.77 39.4,37.52 39.4,36.42 U$9.20 | U$9.20 39.27,36.37 | U$9.20 39.27,35.23 38.51,33.53 31.9,33.6 31.65,34.59 U$9.26
N$15
  Top 0.254: R20.1 29.02,2.59 27.71,2.59 27.08,3.23 R9.2 26.22,5.22 U1.4
N$16
  Top 0.406: PAD1.1 38.76,48.69 IC1.1
N$18
  Top 0.254: 18.91,24.48 18.91,23.71 19.33,23.29 22.58,23.29 22.86,23.01 22.86,21.71 D1.1
  Top 0.61: 18.91,24.48 R11.2
N$19  (via drill 0.6)
  Top 0.254: D1.3 21.77,17.2 22.63,16.33 25.02,16.33 25.93,15.42
  Top 0.305: 36.86,19.08 36.86,19.81 U$9.2
  Top 0.406: 25.93,18.47 v27.71,20.24 | 36.86,19.08 36.71,19.08 v35.71,18.08
  Top 0.61: X1.1 25.93,15.42 25.93,18.47
  Bottom 0.254: 28.61,20.24 v27.71,20.24
  Bottom 0.305: 28.61,20.24 34.57,20.24 35.73,19 35.74,18.98 | v35.71,18.08 35.96,18.22
  Bottom 0.406: 35.74,18.98 35.74,18.11 v35.71,18.08
N$20
  Top 0.406: PAD8.1 37.49,48.69 IC1.2
N$21
  Top 0.305: X1.4 32.92,15.54 U$9.43
N$22
  Top 0.305: X1.5 34.19,16.81 U$9.44
N$23
  Top 0.406: PAD12.1 36.22,48.44 IC1.3
N$24  (via drill 0.6)
  Top 0.61: R12.2 23.9,28.65 | 23.9,28.65 23.9,28.5 v24.56,28.04 | v24.92,24.43 25.17,22.78 25.81,21.89 27.15,21.89 U$9.39 | 23.9,28.65 24.35,27.91 v24.56,28.04 | 23.9,28.65 24.67,28.26 v24.56,28.04 | v24.92,24.43 25.16,24.4 25.05,23.54 24.69,24.33 v24.92,24.43
  Bottom 0.61: v24.56,28.04 24.55,27.14 | 24.55,27.14 24.54,25.25 | 24.54,25.25 24.54,24.82 v24.92,24.43 | 24.54,25.25 | 24.55,27.14 24.8,27.97 v24.56,28.04 | 24.55,27.14 24.32,27.97 v24.56,28.04 | 24.54,25.25 24.67,24.4 | 24.54,25.25 25.11,24.6 | 24.54,25.25 24.67,24.4 | 24.67,24.4 | v24.92,24.43 24.67,24.4 | 24.54,25.25 25.11,24.6 | v24.92,24.43 25.11,24.6 | 24.54,25.25 24.67,24.4 | v24.92,24.43 24.67,24.4 | 24.54,25.25 25.11,24.6 | v24.92,24.43 25.11,24.6
N$25
  Top 0.305: PAD13.1 IC1.4
N$26
  Top 0.305: PAD10.1 IC1.5
N$27
  Top 0.61: PAD5.1 26.44,37.01 24.41,34.98 24.41,34.72 25.93,33.2 U$9.30
N$28
  Top 0.254: U$3.4 8.42,5.1 X2.VBUS
N$29
  Top 0.254: C9.1 0.91,9.13 0.91,5.16 0.97,5.1 U$3.3
N$30  (via drill 0.6)
  Top 0.254: v5.49,12.88 5.49,14.17 | 5.49,14.17 4.81,14.85 | 4.81,14.85 4.72,14.93 2.77,14.93 1.78,15.93 1.78,19.81 | U$3.2 2.06,6.05 v3.15,5.11 | 1.78,19.81 1.78,21.01 1.47,21.31 1.47,22.78 2.9,24.21 7.38,24.21 C1.2 | U$2.1 6.26,14.95 5.49,14.17 | U$2.2 5.42,15.45 4.81,14.85 | R10.1 2.67,18.92 1.78,19.81
  Bottom 0.254: v5.49,12.88 2.01,9.4 2.01,8.46 1.75,8.2 1.75,6.1 2.72,5.13 v3.15,5.11
N$31
  Top 0.254: R10.2 5.32,20.13 4.9,20.55 3.25,20.55 2.84,20.95 2.84,22.02 LED1.A
N$32  (via drill 0.6)
  Top 0.254: U$2.7 10.04,15.45 v11.43,16.26 | v6.88,18.34 6.88,21.64 LED1.C
  Bottom 0.254: v11.43,16.26 10.9,16.81 9.86,17.96 7.32,17.96 v6.88,18.34
N$33
  Top 0.254: R16.1 8.5,18.83 8.74,18.59 8.74,18.01 9.17,17.58 9.17,16.99 U$2.10
N$36
  Top 0.254: R20.2 31.81,2.62 R19.1
N$37
  Top 0.254: R17.2 32.69,7.42 33.78,6.32 35.1,6.32 35.61,5.82 35.61,4.71 R19.2
N$38
  Top 0.254: R18.2 30.77,5.86 30.43,6.2 29.31,6.2 29.26,6.25 29.26,7.38 R17.1
RA0  (via drill 0.6)
  Top 0.254: U$9.3 37.95,19.89 37.95,18.68 | U1.1 23.98,7.24 24.69,7.24 24.99,7.01 24.99,4.75 24.52,4.36 R9.1 24.52,2.07 25.83,0.76 35.79,0.76 36.65,1.63 36.65,9.22 v37.39,9.96
  Top 0.406: 37.95,18.68 v37.95,17.78
  Top 0.61: U1.1
  Bottom 0.254: 37.39,17.12 v37.39,9.96
  Bottom 0.406: 37.39,17.12 37.39,17.22 v37.95,17.78
RA1  (via drill 0.6)
  Top 0.254: 32.28,21.26 32.24,13.6 v32.24,12.71 v32.23,12.7 | R15.1 17.63,12.42 20.73,9.32 | 20.73,9.32 22.2,7.85 24.74,7.85 26.31,9.42 31.19,9.42 v31.8,10.03 | R13.2 19.81,8.41 20.73,9.32
  Top 0.305: 32.28,21.26 32.54,21.51 39.14,21.51 39.27,21.39 U$9.4
  Bottom 0.254: 31.94,10.92 31.94,10.18 v31.8,10.03
  Bottom 0.61: 31.94,10.92 v32.23,12.7
UP_BTN
  Top 0.254: 29.74,32.56 25.43,32.56 23.14,34.85
  Top 0.305: R5.2 17.81,31.84 17.81,34.21 18.44,34.85 PAD28.1 23.14,34.85 | 29.74,32.56 30.25,33.07 30.25,36.17 U$9.27
VCC
  Top 0.254: 41.17,18.34 41.17,21.44 | 29.74,11.94 29.82,26.19 | 29.74,11.94 24.1,11.94 24.03,12.01 24.03,12.34 U$5.2 23.44,14.2 23.5,14.25 | 29.74,11.94 29.95,11.73 30.51,11.73 | 30.51,11.73 33.38,11.73 | 33.38,11.73 40.21,11.73 40.21,12.13 | X1.3 30.51,14.4 30.51,11.73 | IC1.16 38.51,41.5 39.01,42.11 44.35,42.04 | PAD14.1 16.86,24.54 16.92,24.47 | C8.2 16.71,21.03 16.97,20.78 | 45.75,30.05 42.06,30.05 41.55,30.56 41.55,34.24 42.37,35.05 45.83,35.05 45.83,35.33 46,35.49 | U1.5 26.31,7.65 27.31,8.64 32.39,8.64 32.77,9.02 32.77,11.12 33.38,11.73
  Top 0.305: 29.82,26.19 28.98,26.85 U$9.35 | PAD25.1 24.16,44.84 R1.2 24.92,44.08 24.92,42.85 24.41,42.34 22.59,42.34
  Top 0.406: U$9.12 44.53,28.12 45.87,29.46 45.87,29.92 45.75,30.05
  Top 0.61: 41.17,18.34 41.17,13.89 40.31,12.12 40.21,12.13 | 26.37,7.14 U1.5 | U$9.35 22.97,26.85 | 22.97,26.85 R11.1 | 23.5,14.25 16.97,20.78 16.92,24.47 16.92,25.2 17.04,25.32 17.04,28.37 14.88,30.53 14.88,32.56 | 14.88,32.56 18.31,35.99 20.98,35.99 PAD21.1 | 14.88,32.56 14.88,38.66 18.31,42.34 22.59,42.34 | 46,35.49 46,40.56 44.86,41.71 44.35,42.04 44.09,41.58 U$7.4 | 22.97,26.85 22.97,27.52 PAD22.1 | 41.17,21.44 41.17,27.74 41.55,28.12 U$9.12
VO
  Top 0.305: R1.1 R2.1 22.38,46.7 PAD24.1

### Text on the board
tPlace: PAD19 | PAD20 | Rev2
tSilk: P26 | P9 | P24 | P25 | P5 | P10 | P13 | P12 | P8 | P1